# EAGLE design PCB_RLB (EAGLE 9.2.2)
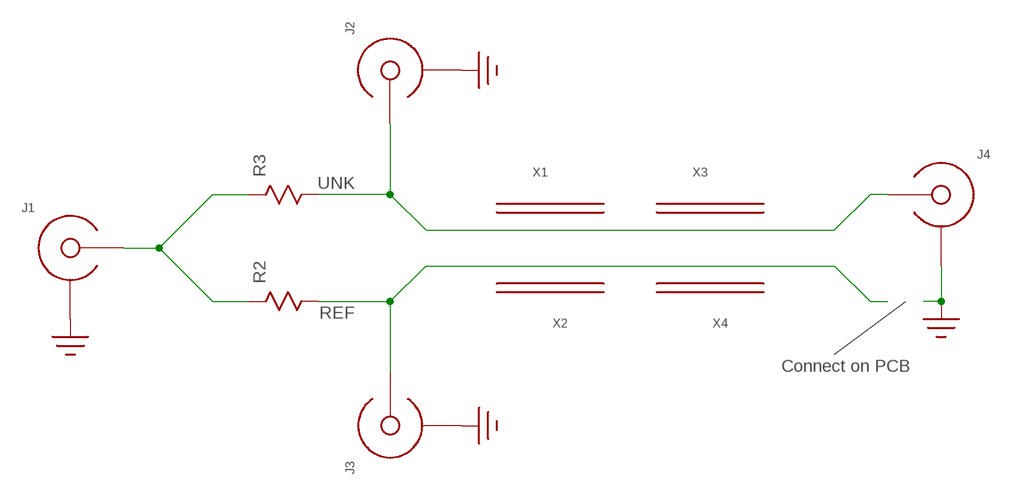
[diagram p0: schematic, sheet 1]

## Parts
J1  EDGE_LAUNCH_JACK  [EDGE_LAUNCH_RF_CON]
J2  EDGE_LAUNCH_JACK  [EDGE_LAUNCH_RF_CON]
J3  EDGE_LAUNCH_JACK  [EDGE_LAUNCH_RF_CON]
J4  EDGE_LAUNCH_JACK  [EDGE_LAUNCH_RF_CON]
R2  R0603  [R0603]
R3  R0603  [R0603]
X1  FERRITE_PLATE  [FERRITE-MP0350]
X2  FERRITE_PLATE  [FERRITE-MP0350]
X3  FERRITE_PLATE  [FERRITE-MP0350]
X4  FERRITE_PLATE  [FERRITE-MP0350]

## Nets
GND: J1.GND@1(SHIELD) J1.GND@2(SHIELD) J1.GND@3(SHIELD) J1.GND@4(SHIELD) J1.GND@5(SHIELD) J1.GND@6(SHIELD) J1.GND@7(SHIELD) J1.GND@8(SHIELD) J1.GND@9(SHIELD) J1.GND@10(SHIELD) J1.GND@11(SHIELD) J1.GND@12(SHIELD) J1.SHIELD@1(SHIELD) J1.SHIELD@2(SHIELD) J2.GND@1(SHIELD) J2.GND@2(SHIELD) J2.GND@3(SHIELD) J2.GND@4(SHIELD) J2.GND@5(SHIELD) J2.GND@6(SHIELD) J2.GND@7(SHIELD) J2.GND@8(SHIELD) J2.GND@9(SHIELD) J2.GND@10(SHIELD) J2.GND@11(SHIELD) J2.GND@12(SHIELD) J2.SHIELD@1(SHIELD) J2.SHIELD@2(SHIELD) J3.GND@1(SHIELD) J3.GND@2(SHIELD) J3.GND@3(SHIELD) J3.GND@4(SHIELD) J3.GND@5(SHIELD) J3.GND@6(SHIELD) J3.GND@7(SHIELD) J3.GND@8(SHIELD) J3.GND@9(SHIELD) J3.GND@10(SHIELD) J3.GND@11(SHIELD) J3.GND@12(SHIELD) J3.SHIELD@1(SHIELD) J3.SHIELD@2(SHIELD) J4.GND@1(SHIELD) J4.GND@2(SHIELD) J4.GND@3(SHIELD) J4.GND@4(SHIELD) J4.GND@5(SHIELD) J4.GND@6(SHIELD) J4.GND@7(SHIELD) J4.GND@8(SHIELD) J4.GND@9(SHIELD) J4.GND@10(SHIELD) J4.GND@11(SHIELD) J4.GND@12(SHIELD) J4.SHIELD@1(SHIELD) J4.SHIELD@2(SHIELD)
N$1: J1.CENTER R2.P$1 R3.P$1
REF: J3.CENTER R2.P$2
UNK: J2.CENTER J4.CENTER R3.P$2

## Notes on the sheet
- Connect on PCB

## Library data of the parts
J1-J4 = yapo:EDGE_LAUNCH_JACK
R2 R3 = yapo:R
X1-X4 = yapo:FERRITE_PLATE

## Net classes
1 100-ohm: width 0.584 mm, clearance 1.016 mm

## Board
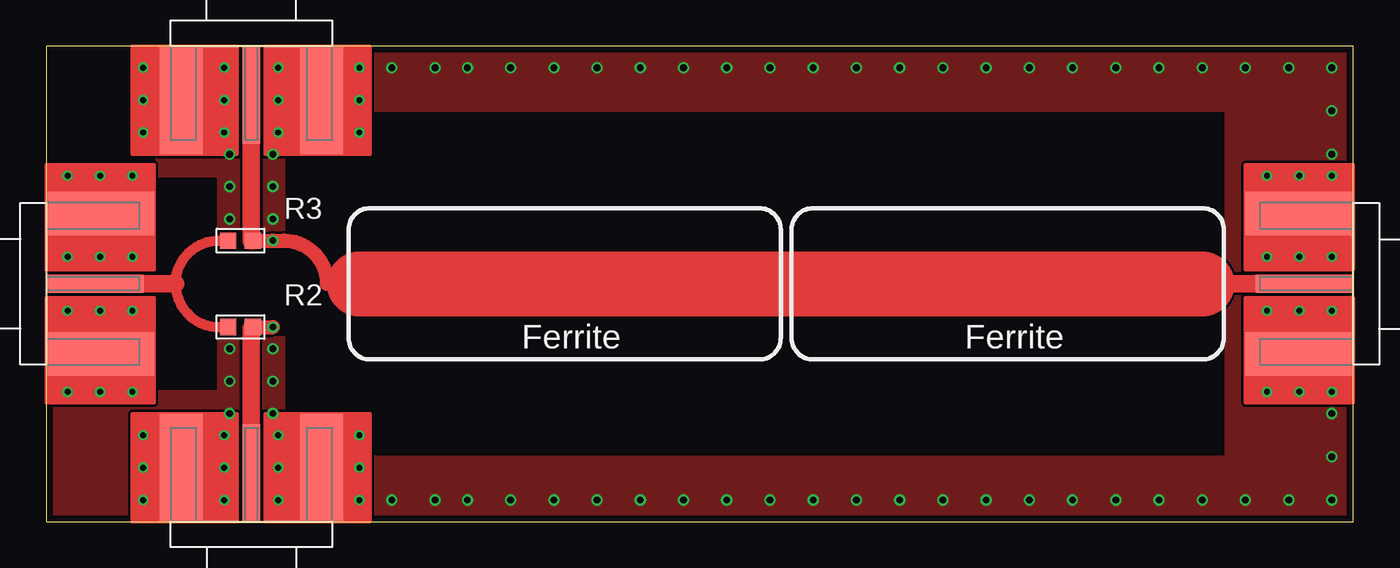
[diagram p1: board, top side]
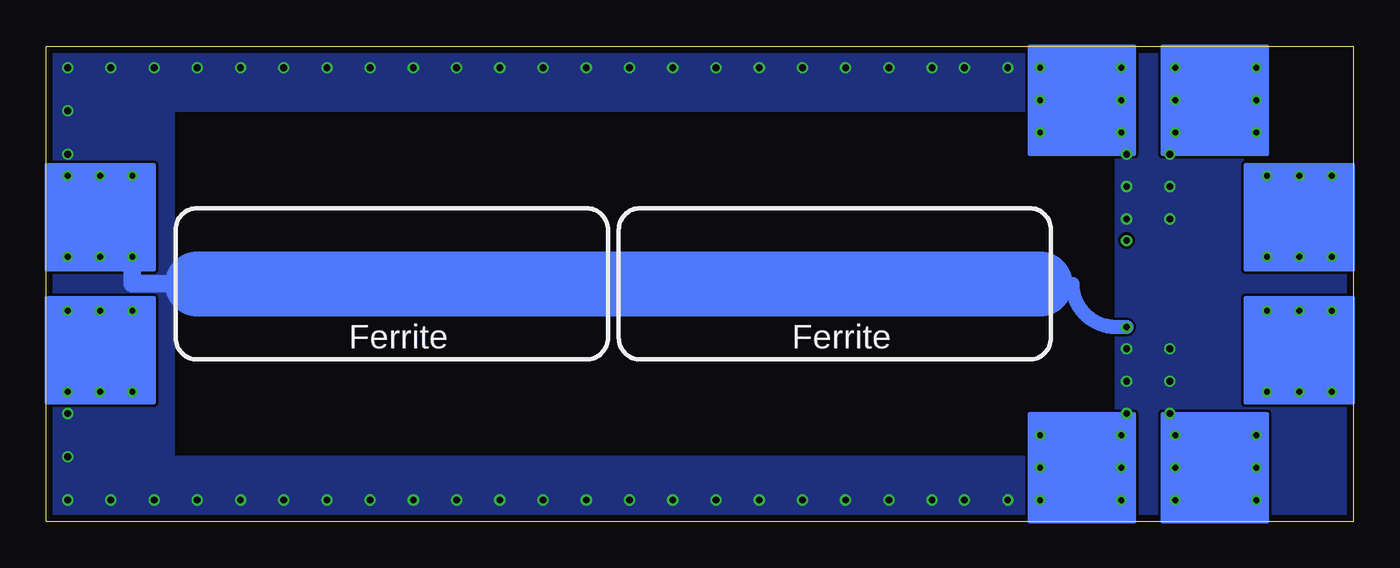
[diagram p2: board, bottom side, seen from below]

Size 76.83 x 27.94 mm. Coordinates in mm from the lower left corner, seen from the top.
Outline: 0,0 76.83,0 76.83,27.94 0,27.94 0,0
Copper layers (1*16): Top 0.035559375mm / dielectric 1.6mm / Bottom 0.035559375mm
Design rules "oshpark-2layer *": minimum track width 6mil, minimum drill 10mil, track to track 6mil, track to pad 6mil, pad to pad 6mil, via to via 6mil, smd to smd 6mil, copper to edge 15mil, drill to drill 6mil, minimum pad ring 5mil, minimum via ring 5mil, stop-mask expansion 2.5mil, vias tented up to drill 30mil, thermal gap 10mil

### Footprints (pad centres in the part's own frame; a part is rotated, then mirrored left to right if it is on the bottom)
EDGE_LAUNCH_RF_CON = smd 5.715 x 1.041: CENTER -2.875,0 | drill 0.35: GND@1 -5.08,1.587; GND@2 -3.175,1.587; GND@3 -1.27,1.587; GND@4 -5.08,-1.587; GND@5 -3.175,-1.587; GND@6 -1.27,-1.587; GND@7 -5.08,6.35; GND@8 -3.175,6.35; GND@9 -1.27,6.35; GND@10 -5.08,-6.35; GND@11 -3.175,-6.35; GND@12 -1.27,-6.35 | smd 6.35 x 2.54: SHIELD@1 -3.175,-4.128; SHIELD@2 -3.175,4.128
R0603 = smd 0.95 x 0.95: P$1 -0.725,0; P$2 0.725,0

### Placement (x,y rotation side)
J1  0,13.97 180 top
J2  12.06,27.94 90 top
J3  12.06,0 270 top
J4  76.83,13.97 0 top
R2  11.43,11.43 0 top
R3  11.43,16.51 0 top
X1  30.48,13.97 0 bottom
X2  30.48,13.97 0 top
X3  56.52,13.97 0 top
X4  56.52,13.97 0 bottom

### Tracks (layer width: path | path; a pad name or v marks a point on that pad's centre or on a via)
GND  (via drill 0.4)
  Bottom 1.041: J4.GND@7 71.75,13.97 67.94,13.97
  Bottom 3.81: 67.94,13.97 18.41,13.97
  other vias: 10.79,17.78 10.79,19.68 13.34,17.78 13.34,19.68 10.79,10.16 13.34,10.16 13.34,8.26 10.79,8.26 10.79,21.59 13.34,21.59 10.79,6.35 13.34,6.35 20.32,26.67 20.32,1.27 22.86,26.67 27.3,26.67 29.84,26.67 32.38,26.67 34.92,26.67 37.47,26.67 40.01,26.67 42.55,26.67 45.09,26.67 47.62,26.67 50.16,26.67 52.7,26.67 55.24,26.67 57.78,26.67 60.33,26.67 62.87,26.67 65.41,26.67 67.94,26.67 70.48,26.67 73.03,26.67 22.86,1.27 27.3,1.27 29.84,1.27 32.38,1.27 34.92,1.27 37.47,1.27 40.01,1.27 42.55,1.27 45.09,1.27 50.16,1.27 47.62,1.27 52.7,1.27 55.24,1.27 57.78,1.27 60.33,1.27 62.87,1.27 65.41,1.27 67.94,1.27 70.48,1.27 73.03,1.27 75.56,26.67 75.56,1.27 75.56,3.81 75.56,24.13 75.56,21.59 75.56,6.35 24.77,26.67 24.77,1.27
  pour Top (no thermals): 0,20.95 7.24,20.95 7.24,6.99 0,6.99
  pour Top (no thermals): 0,0 19.05,0 19.05,6.35 13.97,6.35 13.97,10.79 10.16,10.79 10.16,7.62 0,7.62
  pour Top (no thermals): 10.16,17.14 13.97,17.14 13.97,21.59 19.05,21.59 19.05,27.94 0,27.94 0,20.32 10.16,20.32
  pour Bottom (no thermals): 0,0 13.97,0 13.97,27.94 0,27.94
  pour Bottom (no thermals): 17.14,27.94 76.83,27.94 76.83,24.13 17.14,24.13
  pour Bottom (no thermals): 17.14,3.81 76.83,3.81 76.83,0 17.14,0
  pour Bottom (no thermals): 76.83,27.94 69.34,27.94 69.34,0 76.83,0
  pour Top (no thermals): 76.83,0 76.83,27.94 69.34,27.94 69.34,0
  pour Top (no thermals): 76.83,24.13 76.83,27.94 15.24,27.94 15.24,24.13
  pour Top (no thermals): 76.83,0 76.83,3.81 15.88,3.81 15.88,0
N$1
  Top 0.584: R3.P$1 10.16,16.51 arc90 7.62,13.97 arc90 10.16,11.43 R2.P$1
  Top 1.041: J1.CENTER 7.62,13.97
REF  (via drill 0.4)
  Top 0.813: R2.P$2 v13.34,11.43
  Top 1.041: J3.CENTER 12.06,11.34 arc-90 R2.P$2
  Bottom 0.584: 16.51,13.97 18.41,13.97
  Bottom 0.813: v13.34,11.43 13.97,11.43 arc90 16.51,13.97
UNK  (via drill 0.4)
  Top 0.584: 16.51,13.97 18.41,13.97
  Top 0.813: R3.P$2 v13.34,16.51 13.97,16.51 arc-90 16.51,13.97
  Top 1.041: J2.CENTER 12.06,16.51 R3.P$2 | J4.CENTER 67.94,13.97
  Top 3.81: 18.41,13.97 67.94,13.97